# EAGLE design main (EAGLE 9.6.2)
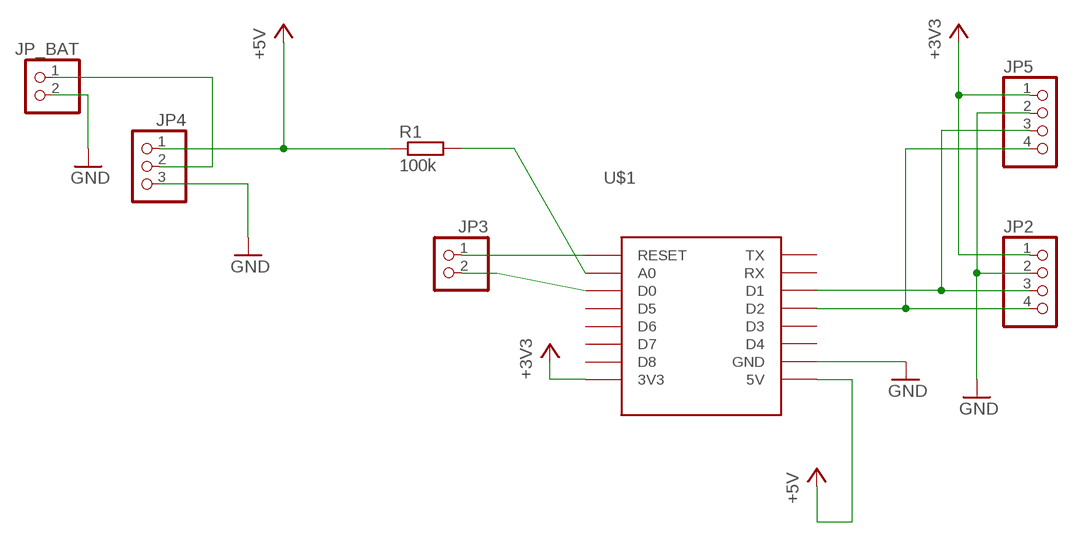
[diagram p0: schematic, sheet 1]

## Parts
JP2  PINHD-1X4  [1X04]
JP3  PINHD-1X2  [1X02]
JP4  PINHD-1X3  [1X03]
JP5  PINHD-1X4  [1X04]
JP_BAT  PINHD-1X2  [1X02]
R1  100k  R-EU_R0805  [R0805]
U$1  WEMOS-D1-MINI  [WEMOS-D1-MINI]

## Nets
+3V3: JP2.1 JP5.1 U$1.3V3
+5V: JP4.1 R1.1 U$1.5V
GND: JP2.2 JP4.3 JP5.2 JP_BAT.2 U$1.GND
N$1: JP4.2 JP_BAT.1
N$2: R1.2 U$1.A0
N$3: JP3.2 U$1.D0
N$4: JP3.1 U$1.RESET
N$5: JP2.4 JP5.4 U$1.D2
N$7: JP2.3 JP5.3 U$1.D1
Unconnected: U$1.D3 U$1.D4 U$1.D5 U$1.D6 U$1.D7 U$1.D8 U$1.RX U$1.TX

## Library data of the parts
JP2 JP5 = pinhead:PINHD-1X4: PIN HEADER
JP3 JP_BAT = pinhead:PINHD-1X2: PIN HEADER
JP4 = pinhead:PINHD-1X3: PIN HEADER
R1 = resistor:R-EU_: RESISTOR, European symbol
U$1 = esp8266modules:WEMOS-D1-MINI: WeMos.cc D1 mini ESP8266 module

## Board
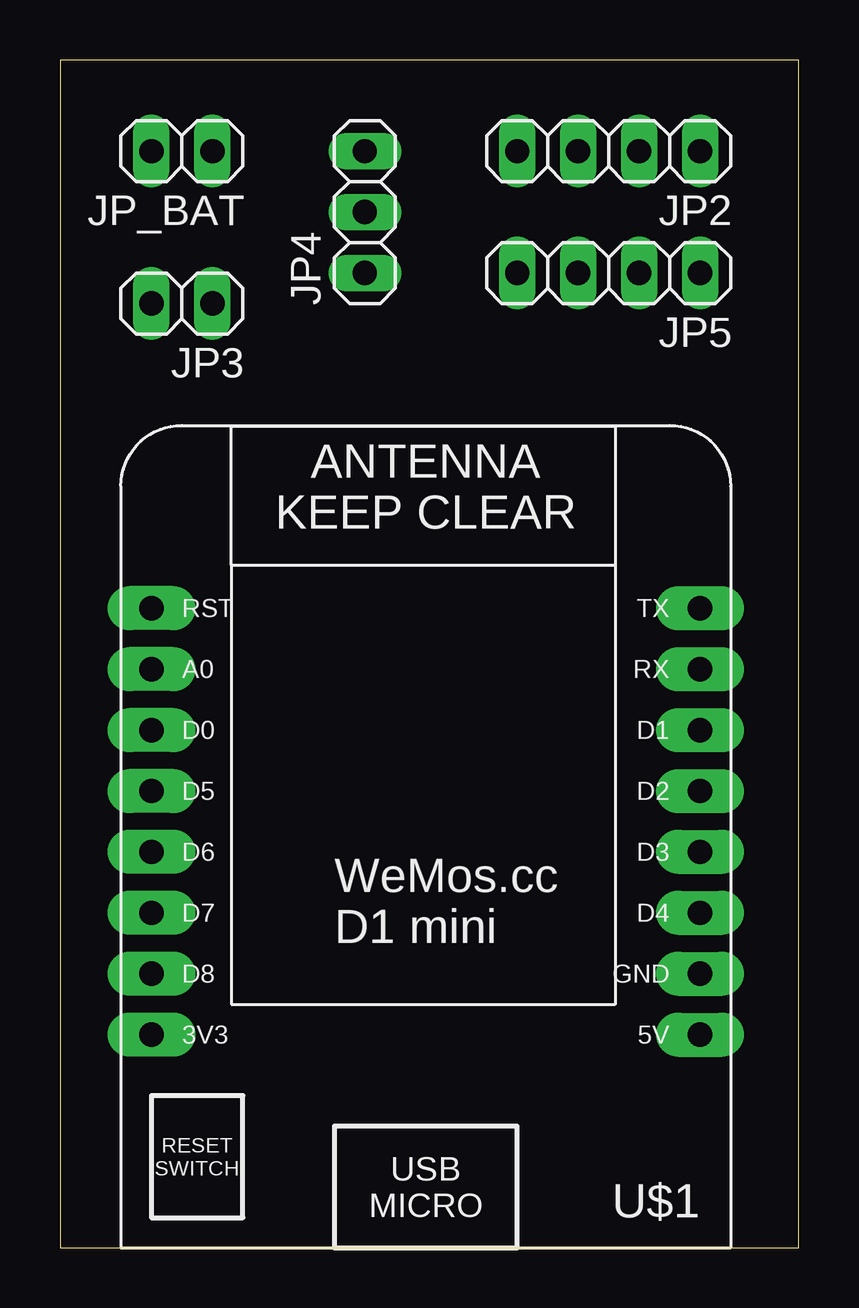
[diagram p1: board, top side]
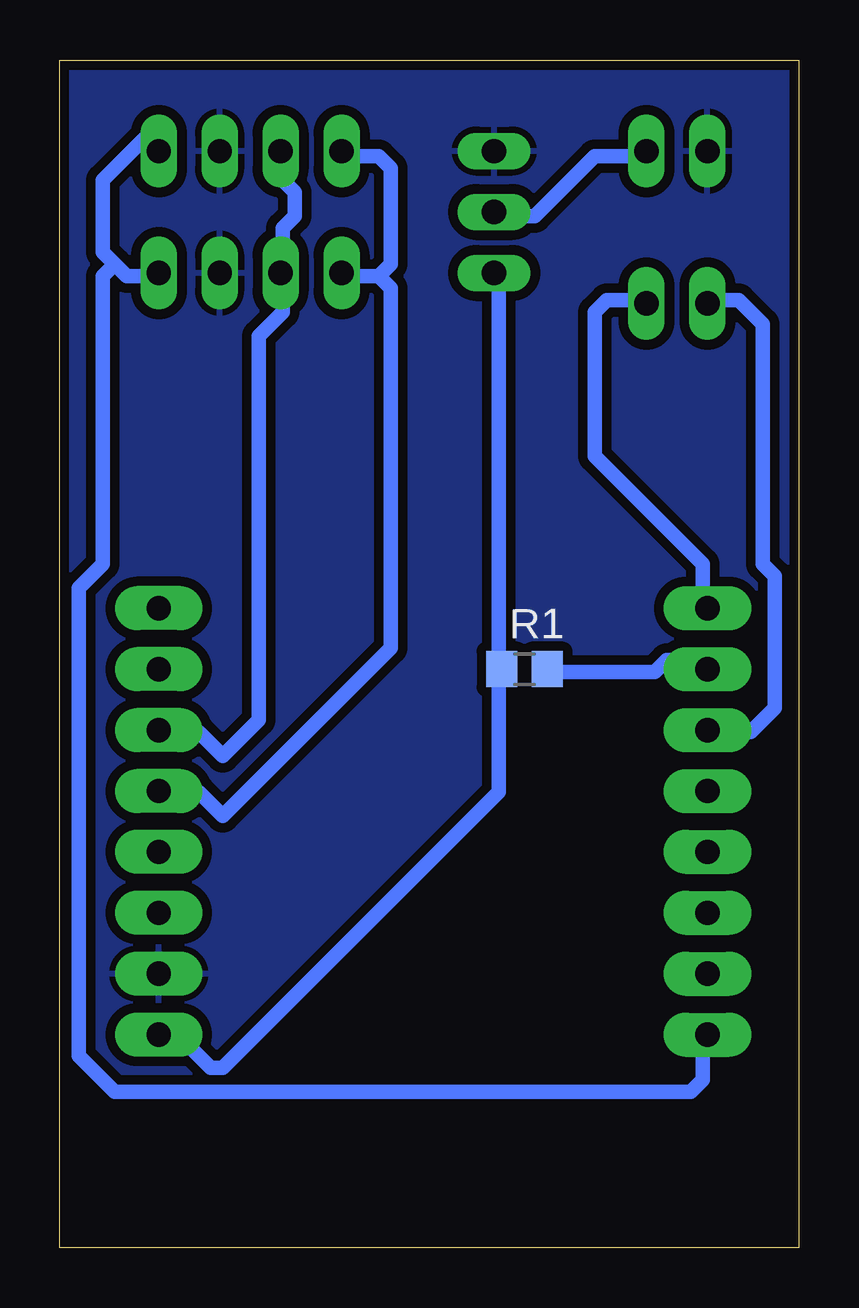
[diagram p2: board, bottom side, seen from below]

Size 30.79 x 49.52 mm. Coordinates in mm from the lower left corner, seen from the top.
Outline: 0,0 30.79,0 30.79,49.52 0,49.52 0,0
Copper layers (1*16): Top 0.035mm / dielectric 1.5mm / Bottom 0.035mm
Design rules "main": minimum track width 0.6mm, minimum drill 0.35mm, track to track 0.4mm, track to pad 0.4mm, pad to pad 0.4mm, via to via 0.4mm, smd to smd 0.4mm, copper to edge 0.4mm, drill to drill 0.4mm, minimum pad ring 10mil, minimum via ring 8mil, stop-mask expansion 4mil, vias tented up to drill 0mil, thermal gap 10mil

### Footprints (pad centres in the part's own frame; a part is rotated, then mirrored left to right if it is on the bottom)
1X04 = drill 1.016 long: 1 -3.81,0; 2 -1.27,0; 3 1.27,0; 4 3.81,0
1X02 = drill 1.016 long: 1 -1.27,0; 2 1.27,0
1X03 = drill 1.016 long: 1 -2.54,0; 2 0,0; 3 2.54,0
R0805 = smd 1.3 x 1.5: 1 -0.95,0; 2 0.95,0
WEMOS-D1-MINI = drill 1.016 pad 1.829 long: 3V3 -10.16,-10.16; 5V 12.7,-10.16; A0 -10.16,5.08; D0 -10.16,2.54; D1 12.7,2.54; D2 12.7,0; D3 12.7,-2.54; D4 12.7,-5.08; D5 -10.16,0; D6 -10.16,-2.54; D7 -10.16,-5.08; D8 -10.16,-7.62; GND 12.7,-7.62; RESET -10.16,7.62; RX 12.7,5.08; TX 12.7,7.62

### Placement (x,y rotation side)
JP2  22.86,45.72 180 top
JP3  5.08,39.37 180 top
JP4  12.7,43.18 90 top
JP5  22.86,40.64 180 top
JP_BAT  5.08,45.72 180 top
R1  11.43,24.13 0 bottom
U$1  13.97,19.05 0 top

### Tracks (layer width: path | path; a pad name or v marks a point on that pad's centre or on a via)
+3V3
  Bottom 0.6: 28.5,41 29,41.5 29,44.5 27,46.5 26.5,46 JP2.1 | 28.5,41 28,40.5 27,40.5 JP5.1 | 28.5,41 29,40.5 29,28.5 30,27.5 30,8 28.5,6.5 4.5,6.5 4,7 4,8.5 U$1.3V3
+5V
  Bottom 0.6: JP4.1 12.5,40.5 12.5,24.5 R1.1 12.5,24 12.5,19 24,7.5 24.5,7.5 25.5,8.5 26.5,8.5 U$1.5V
GND
  pour Bottom: 0,52.07 31.75,52.07 31.75,0 0,0
N$1
  Bottom 0.6: JP_BAT.1 6.5,45.5 8.5,45.5 11,43 12.5,43 JP4.2
N$2
  Bottom 0.6: R1.2 10,24 6,24 5.5,24.5 4,24.5 U$1.A0
N$3
  Bottom 0.6: JP3.2 3.5,39.5 2.5,39.5 1.5,38.5 1.5,28.5 1,28 1,22.5 2,21.5 3.5,21.5 U$1.D0
N$4
  Bottom 0.6: JP3.1 6.5,39.5 8,39.5 8.5,39 8.5,33 4,28.5 4,27 U$1.RESET
N$5
  Bottom 0.6: 17.5,40.5 19,40.5 JP5.4 | 17.5,40.5 17,41 17,45 17.5,45.5 19,45.5 JP2.4 | 17.5,40.5 17,40 17,25 24,18 25,19 26.5,19 U$1.D2
N$7
  Bottom 0.6: JP2.3 21.5,45.5 21.5,44.5 21,44 21,43 21.5,42.5 21.5,41 JP5.3 21.5,40.5 21.5,39 22.5,38 22.5,22 24,20.5 25,21.5 26.5,21.5 U$1.D1